# EAGLE design Caricabatteria 1.0 (EAGLE 9.5.2)
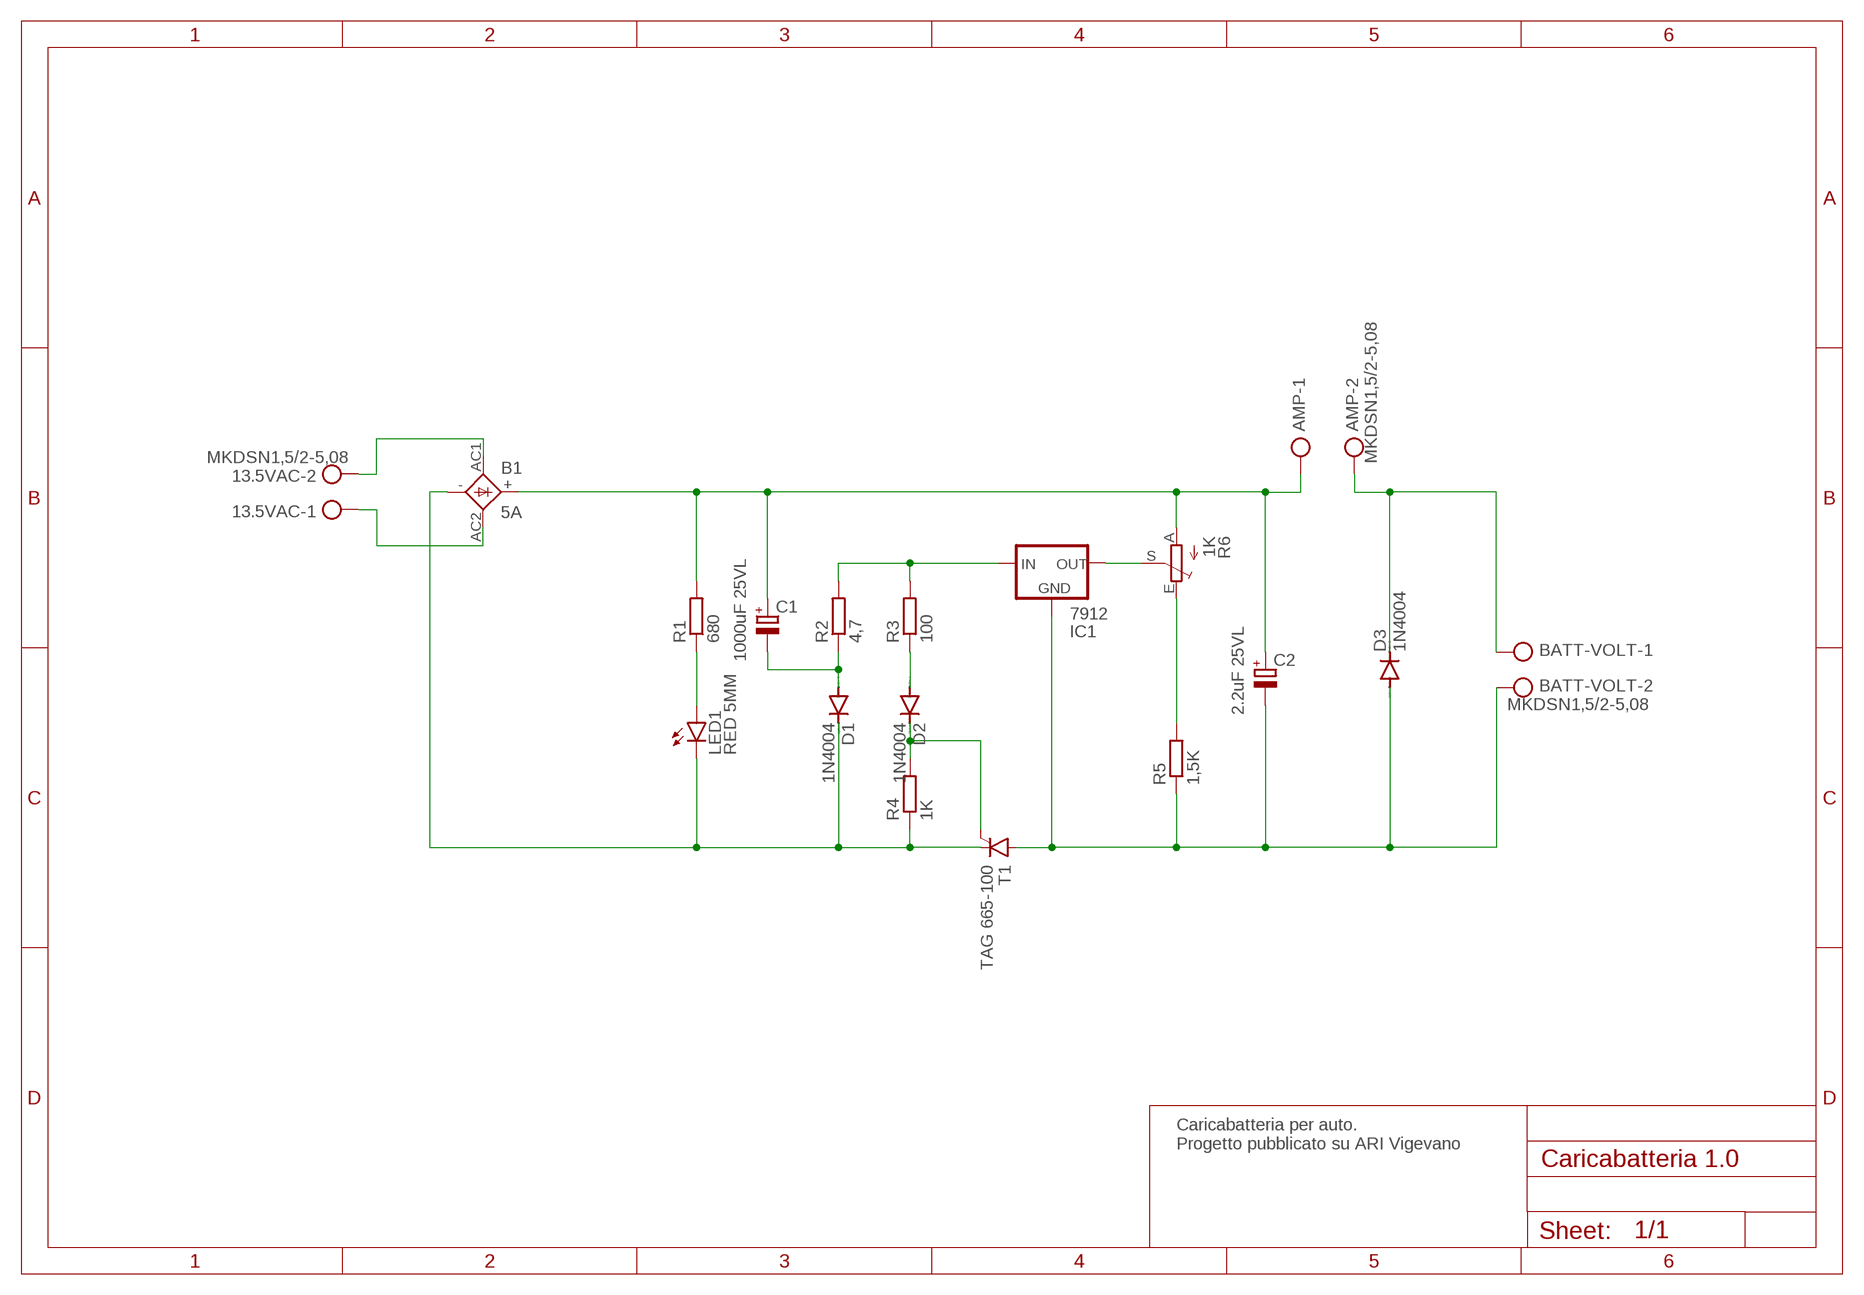
[diagram p0: schematic, sheet 1]

## Parts
13.5VAC  MKDSN1,5/2-5,08  [MKDSN1,5/2-5,08]
AMP  MKDSN1,5/2-5,08  [MKDSN1,5/2-5,08]
B1  5A  SKB  [SKB]
BATT-VOLT  MKDSN1,5/2-5,08  [MKDSN1,5/2-5,08]
C1  1000uF 25VL  CPOL-EUE5-10.5  [E5-10,5]
C2  2.2uF 25VL  CPOL-EUE5-10.5  [E5-10,5]
D1  1N4004  [DO41-10]
D2  1N4004  [DO41-10]
D3  1N4004  [DO41-10]
IC1  7912  79XXS  [79XXS]
LED1  RED 5MM  LED5MM  [LED5MM]
R1  680  R-EU_0207/10  [0207/10]
R2  4,7  R-EU_0207/10  [0207/10]
R3  100  R-EU_0207/10  [0207/10]
R4  1K  R-EU_0207/10  [0207/10]
R5  1,5K  R-EU_0207/10  [0207/10]
R6  1K  TRIM_EU-PT10S  [PT-10S]
T1  TAG 665-100  BTW68  [TOP3S-2]

## Nets
N$1: C1.- D1.A R2.1
N$2: LED1.A R1.1
N$3: AMP.2 BATT-VOLT.1 D3.C
N$4: D2.A R3.1
N$5: D2.C R4.2 T1.G
N$6: IC1.IN R2.2 R3.2
N$7: B1.- D1.C LED1.K(C) R4.1 T1.C
N$8: BATT-VOLT.2 C2.- D3.A IC1.GND R5.1 T1.A
N$9: IC1.OUT R6.S
N$10: R5.2 R6.E
N$11: AMP.1 B1.+ C1.+ C2.+ R1.2 R6.A
N$12: 13.5VAC.2 B1.AC1
N$13: 13.5VAC.1 B1.AC2

## Notes on the sheet
- Caricabatteria per auto.
  Progetto pubblicato su ARI Vigevano

## Library data of the parts
13.5VAC AMP BATT-VOLT = con-phoenix-508-IZ0VLL:MKDSN1,5/2-5,08: MKDSN 1,5/ 2-5,08 Printklemme Nennstrom: 13,5 A Nennspannung: 250 V Rastermaß: 5,08 mm Polzahl: 2 Anschlussart: Schraubanschluss Montage: Löten Anschlussrichtung Leiter/Platine: 0 ° Artikelnummer: 1729128 Source: http://eshop.phoenixcontact.com .. 1729128.pdf
B1 = rectifier-IZ0VLL:SKB: SEMIKRON RECTIFIER
C1 C2 = rcl-IZ0VLL:CPOL-EU: POLARIZED CAPACITOR, European symbol; SPICEPREFIX: C
D1-D3 = diode-IZ0VLL:1N4004: DIODE general purpose rectifier, 1 A
IC1 = v-reg:79XXS: VOLTAGE REGULATOR
LED1 = led-IZ0VLL:LED: LED OSRAM: - CHIPLED LG R971, LG N971, LY N971, LG Q971, LY Q971, LO R971, LY R971 LH N974, LH R974 LS Q976, LO Q976, LY Q976 LO Q996 - Hyper CHIPLED LW Q18S LB Q993, LB Q99A, LB R99A - SideLED LS A670, LO A670, LY A670, LG A670, LP A670 LB A673, LV A673, LT A673, LW A673 LH A674 LY A675 LS A676, LA A676, LO A676, LY A676, LW A676 LS A679, LY A679, LG A679 - Hyper Micro SIDELED® LS Y876, LA Y876, LO Y876, LY Y876 LT Y87S - SmartLED LW L88C, LW L88S LB L89C, LB L89S, LG L890 LS L89K, LO L89K, LY L89K LS L896, LA L896, LO L896, LY L896 - TOPLED LS T670, LO T670, LY T670, LG T670, LP T670 LSG T670, LSP T670, LSY T670, LOP T670, LYG T670 LG T671, LOG T671, LSG T671 LB T673, LV T673, LT T673, LW T673 LH T674 LS T676, LA T676, LO T676, LY T676, LB T676, LH T676, LSB T676, LW T676 LB T67C, LV T67C, LT T67C, LS T67K, LO T67K, LY T67K, LW E67C LS E67B, LA E67B, LO E67B, LY E67B, LB E67C, LV E67C, LT E67C LW T67C LS T679, LY T679, LG T679 LS T770, LO T770, LY T770, LG T770, LP T770 LB T773, LV T773, LT T773, LW T773 LH T774 LS E675, LA E675, LY E675, LS T675 LS T776, LA T776, LO T776, LY T776, LB T776 LHGB T686 LT T68C, LB T68C - Hyper Mini TOPLED® LB M676 - Mini TOPLED Santana® LG M470 LS M47K, LO M47K, LY M47K Source: http://www.osram.convergy.de LUXEON: - LUMILED® LXK2-PW12-R00, LXK2-PW12-S00, LXK2-PW14-U00, LXK2-PW14-V00 LXK2-PM12-R00, LXK2-PM12-S00, LXK2-PM14-U00 LXK2-PE12-Q00, LXK2-PE12-R00, LXK2-PE12-S00, LXK2-PE14-T00, LXK2-PE14-U00 LXK2-PB12-K00, LXK2-PB12-L00, LXK2-PB12-M00, LXK2-PB14-N00, LXK2-PB14-P00, LXK2-PB14-Q00 LXK2-PR12-L00, LXK2-PR12-M00, LXK2-PR14-Q00, LXK2-PR14-R00 LXK2-PD12-Q00, LXK2-PD12-R00, LXK2-PD12-S00 LXK2-PH12-R00, LXK2-PH12-S00 LXK2-PL12-P00, LXK2-PL12-Q00, LXK2-PL12-R00 Source: www.luxeon.com KINGBRIGHT: KA-3528ASYC Source: www.kingbright.com
R1-R5 = rcl-IZ0VLL:R-EU_: RESISTOR, European symbol; SPICEPREFIX: R
R6 = pot:TRIM_EU-: POTENTIOMETER
T1 = triac-IZ0VLL:BTW68: THYRISTOR

## Board
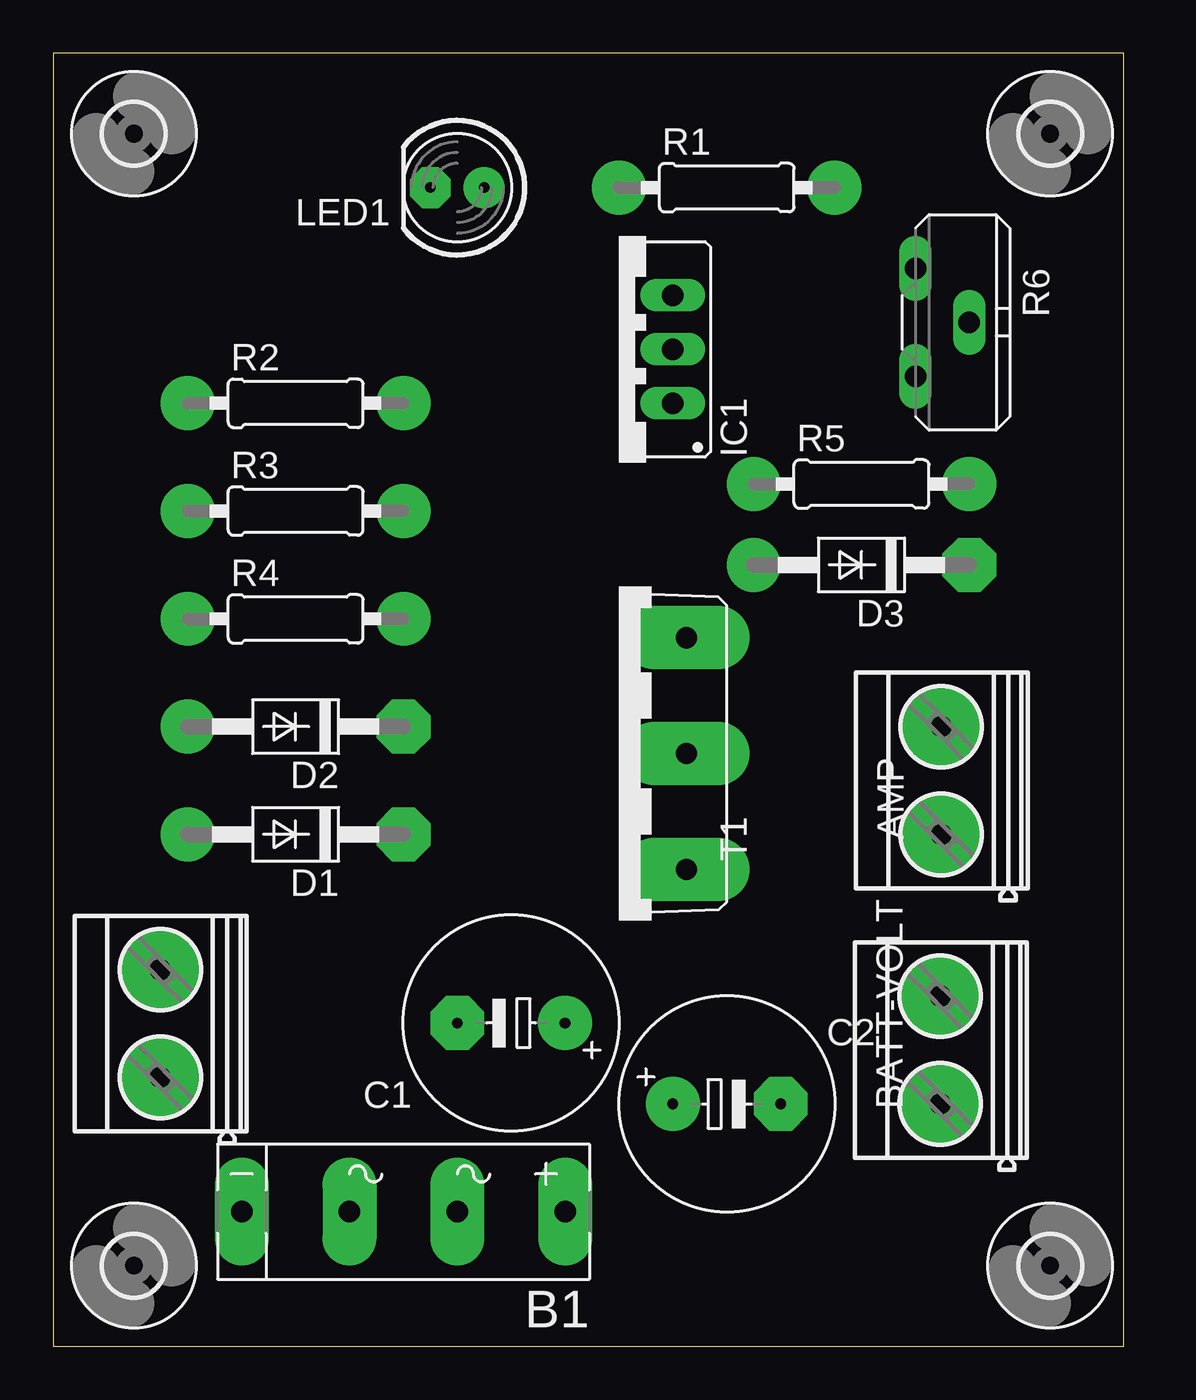
[diagram p1: board, top side]
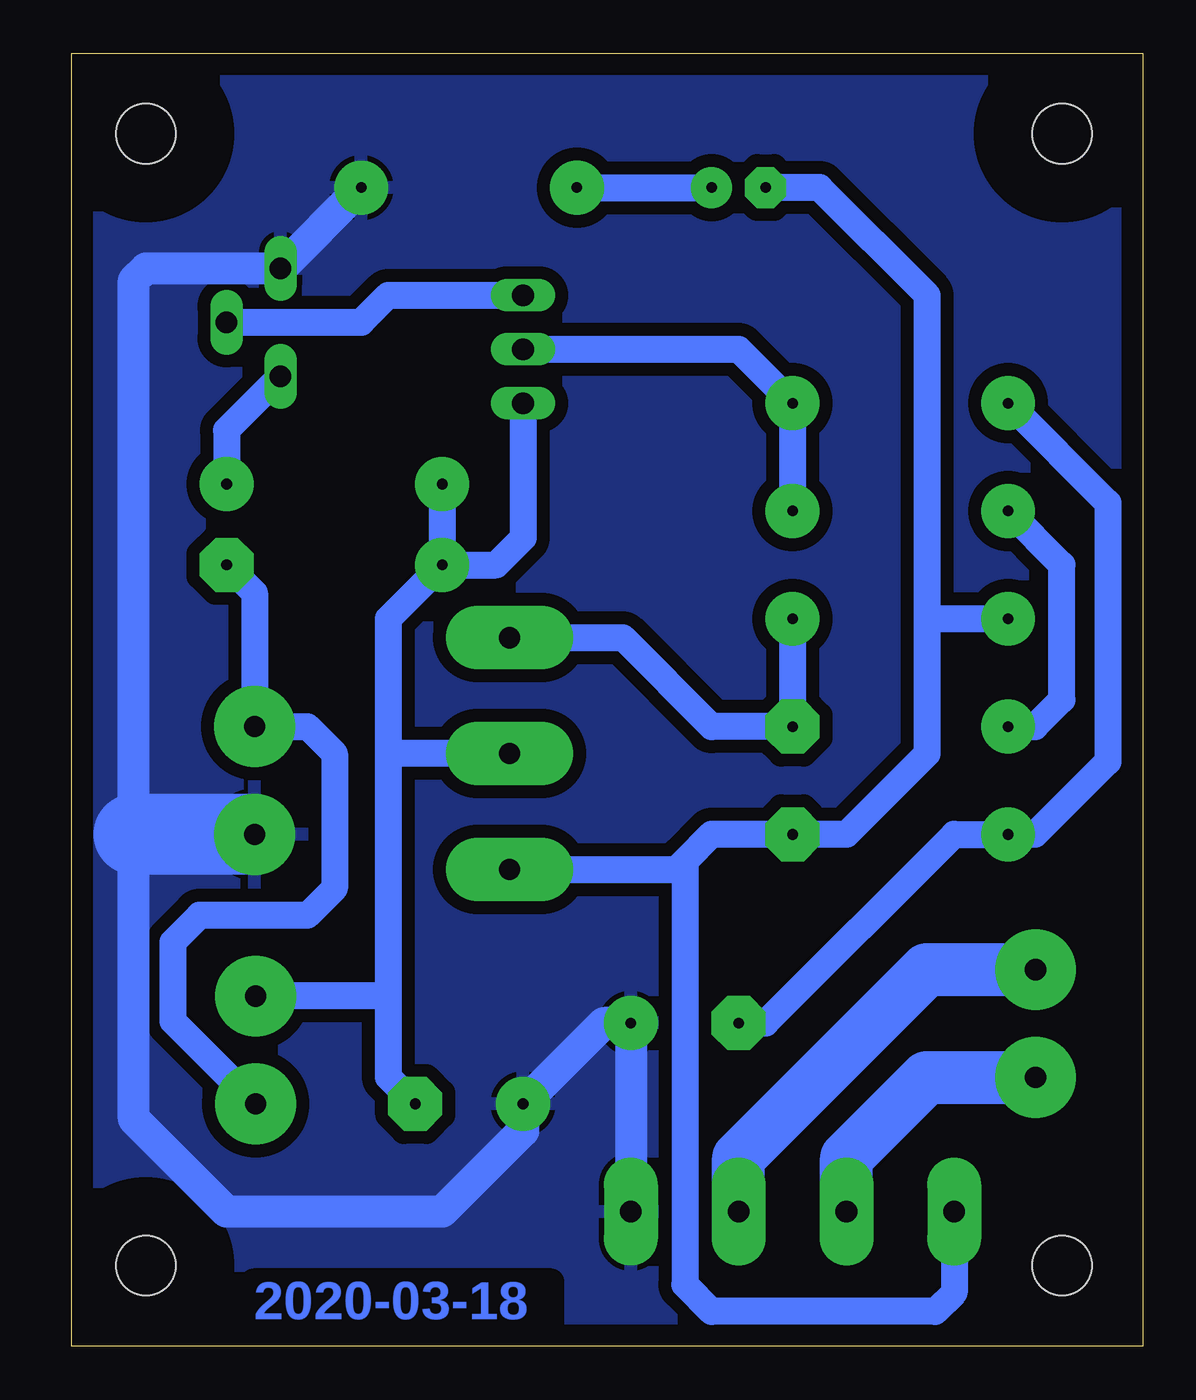
[diagram p2: board, bottom side, seen from below]

Size 50.47 x 60.95 mm. Coordinates in mm from the lower left corner, seen from the top.
Outline: 0,0 50.47,0 50.47,60.95 0,60.95 0,0
Copper layers (1*16): Top 0.035mm / dielectric 1.5mm / Bottom 0.035mm
Design rules "default": minimum track width 6mil, minimum drill 0.35mm, track to track 6mil, track to pad 6mil, pad to pad 6mil, via to via 6mil, smd to smd 6mil, copper to edge 40mil, drill to drill 6mil, minimum pad ring 10mil, minimum via ring 8mil, stop-mask expansion 4mil, vias tented up to drill 0mil, thermal gap 10mil

### Footprints (pad centres in the part's own frame; a part is rotated, then mirrored left to right if it is on the bottom)
MKDSN1,5/2-5,08 = drill 1 pad 3.81: 1 -2.561,0.025; 2 2.519,0.025
SKB = drill 1.016 pad 2.54 long: + -7.62,0; - 7.62,0; AC1 -2.54,0; AC2 2.54,0
E5-10,5 = drill 0.5 pad 2.54: + -2.54,0 | drill 0.5 pad 2.54 octagon: - 2.54,0
DO41-10 = drill 0.5 pad 2.54: A 5.08,0 | drill 0.5 pad 2.54 octagon: C -5.08,0
79XXS = drill 1.016 long: GND -2.54,-2.54; IN 0,-2.54; OUT 2.54,-2.54
LED5MM = drill 0.5 pad 1.93: A -1.27,0 | drill 0.5 pad 1.93 octagon: K 1.27,0
0207/10 = drill 0.5 pad 2.54: 1 -5.08,0; 2 5.08,0
PT-10S = drill 1.016 long: A -2.54,-1.27; E 2.54,-1.27; S 0,1.27
TOP3S-2 = drill 1 pad 3 long: A 0,-3.175; C -5.461,-3.175; G 5.461,-3.175
2,8 = hole 2.8: 0,0

### Placement (x,y rotation side)
13.5VAC  5.08,15.24 90 top
AMP  41.88,26.69 90 top
B1  16.51,6.35 180 top
BATT-VOLT  41.84,13.99 90 top
C1  21.59,15.24 180 top
C2  31.75,11.43 0 top
D1  11.43,24.13 180 top
D2  11.43,29.21 180 top
D3  38.1,36.83 180 top
IC1  26.67,46.99 90 top
LED1  19.05,54.61 180 top
R1  31.75,54.61 0 top
R2  11.43,44.45 0 top
R3  11.43,39.37 0 top
R4  11.43,34.29 0 top
R5  38.1,40.64 0 top
R6  41.91,48.26 270 top
T1  26.67,27.94 90 top
U$1  [2,8]  46.99,57.15 0 top
U$2  [2,8]  3.81,57.15 0 top
U$3  [2,8]  3.81,3.81 0 top
U$4  [2,8]  46.99,3.81 0 top

### Tracks (layer width: path | path; a pad name or v marks a point on that pad's centre or on a via)
N$1
  Bottom 1.27: R2.1 1.65,39.75 1.65,27.56 5.08,24.13 D1.A 8.89,24.13 17.78,15.24 C1.-
N$2
  Bottom 1.27: R1.1 LED1.A
N$3
  Bottom 1.27: BATT-VOLT.1 45.72,15.34 45.72,19.05 44.45,20.32 39.37,20.32 38.1,21.59 38.1,27.94 39.37,29.21 AMP.2 41.86,35.51 D3.C
N$4
  Bottom 1.27: D2.A 5.08,29.21 3.81,30.48 3.81,36.83 R3.1
N$5
  Bottom 1.27: T1.G 24.51,33.4 20.32,29.21 D2.C R4.2
N$6
  Bottom 1.27: R3.2 R2.2 19.05,46.99 IC1.IN
N$7
  Bottom 1.27: 10.16,34.29 10.16,27.94 13.97,24.13 D1.C 20.32,24.13 21.59,22.86 | R4.1 10.16,34.29 | B1.- 8.89,2.54 9.78,1.65 20.32,1.65 21.59,2.92 21.59,22.86 | 10.16,34.29 10.16,49.53 15.24,54.61 LED1.K | T1.C 21.97,22.48 21.59,22.86
N$8
  Bottom 1.27: R5.1 D3.A | IC1.GND 29.21,38.1 30.48,36.83 D3.A | D3.A 35.56,34.29 35.56,27.94 | 35.56,16.51 35.56,12.7 C2.- | T1.A 35.56,27.94 | 35.56,16.51 BATT-VOLT.2 | 35.56,27.94 35.56,16.51
N$9
  Bottom 1.27: IC1.OUT 35.56,49.53 36.83,48.26 R6.S
N$10
  Bottom 1.27: R6.E 43.18,43.18 R5.2
N$11
  Bottom 1.5: R1.2 R6.A 46.99,50.8 47.55,50.24 47.55,24.13 47.55,10.72 43.18,6.35 33.02,6.35 29.21,10.16 C2.+ 25.4,15.24 C1.+ B1.+
  Bottom 3.81: AMP.1 47.55,24.13
  pour Bottom (isolate 0.61): -1.27,62.23 52.07,62.23 52.07,-1.27 -1.27,-1.27
N$12
  Bottom 2.5: B1.AC1 19.05,8.89 10.18,17.76 13.5VAC.2
N$13
  Bottom 2.5: B1.AC2 13.97,8.89 10.18,12.68 13.5VAC.1

### Text on the board
Bottom: 2020-03-18
tDocu: Salvatore Mele, IZ0VLL | AMPEROMETRO | CARICABATTERIA AUTO / ARI VIGEVANO | AC IN * 13.5V | BATT-VOLT